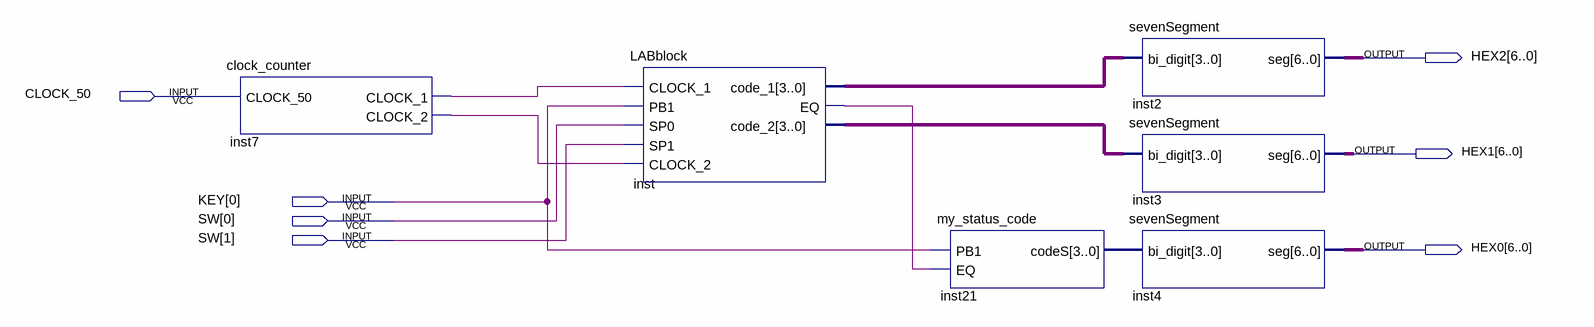
[diagram p0: schematic sheet]
// Quartus schematic Lab7.bdf as structural Verilog: 6 symbols, 7 pins
module Lab7 (
  input  CLOCK_50,
  input  [0:0] KEY,
  input  [1:0] SW,
  output [6:0] HEX2,
  output [6:0] HEX1,
  output [6:0] HEX0
);

  wire inst7_clock_1, inst7_clock_2, inst_eq;
  wire [3:0] inst21_codes, inst_code_1, inst_code_2;

  clock_counter inst7 (.CLOCK_50(CLOCK_50), .CLOCK_1(inst7_clock_1), .CLOCK_2(inst7_clock_2));
  LABblock inst (
    .CLOCK_1(inst7_clock_1), .PB1(KEY[0]), .SP0(SW[0]), .SP1(SW[1]), .CLOCK_2(inst7_clock_2),
    .code_1(inst_code_1), .EQ(inst_eq), .code_2(inst_code_2));
  my_status_code inst21 (.PB1(KEY[0]), .EQ(inst_eq), .codeS(inst21_codes));
  sevenSegment inst2 (.bi_digit(inst_code_1), .seg(HEX2));
  sevenSegment inst3 (.bi_digit(inst_code_2), .seg(HEX1));
  sevenSegment inst4 (.bi_digit(inst21_codes), .seg(HEX0));
endmodule
